# EAGLE design 153-01C Mode X LPT adapter (EAGLE 6.6.0)
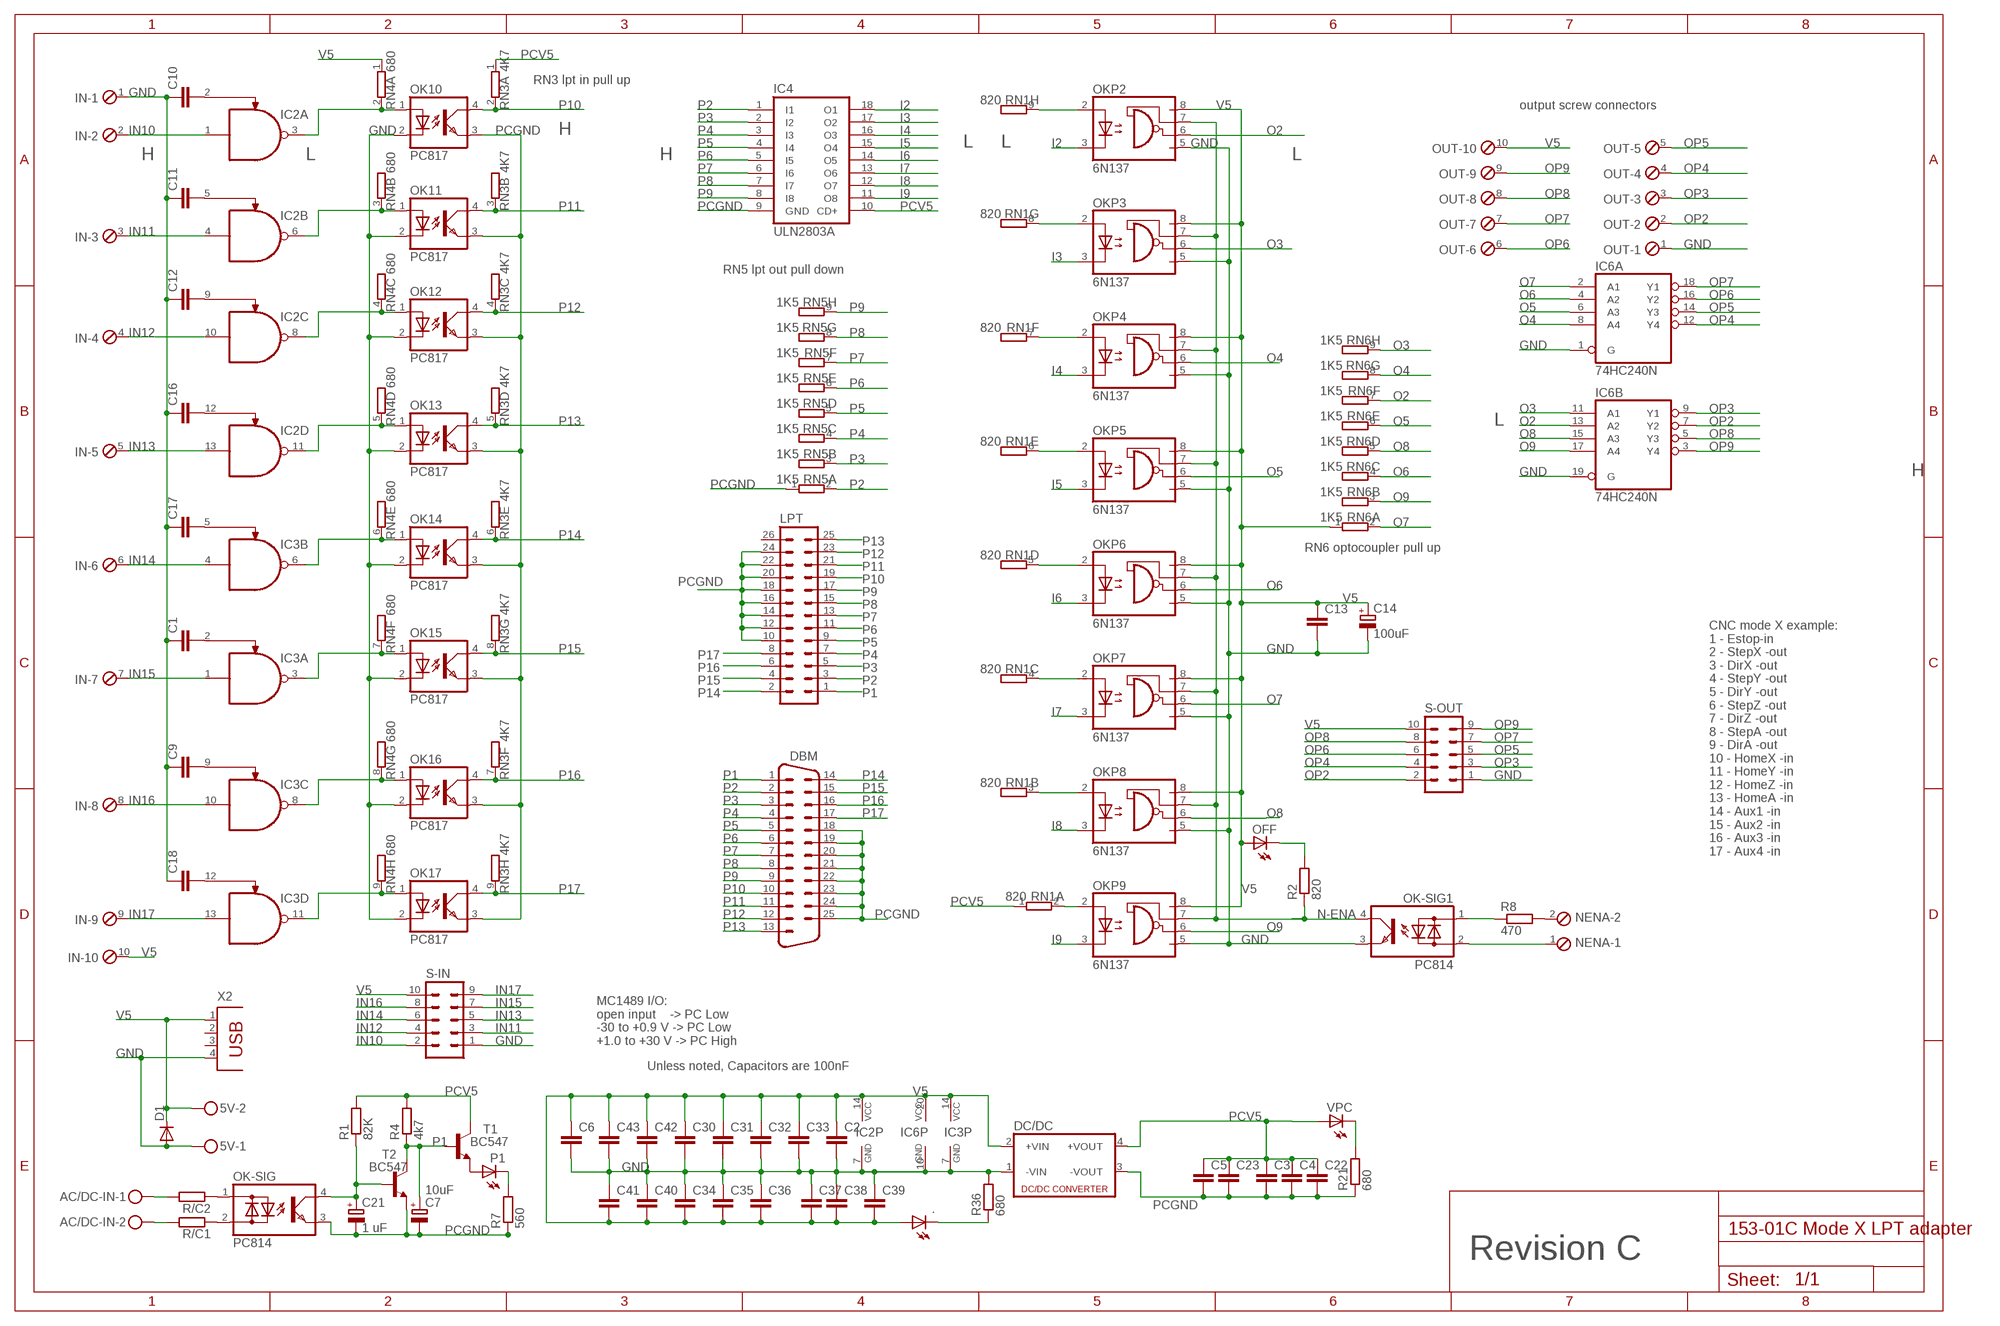
[diagram p0: schematic, sheet 1]

## Parts
5V  MKDSN1,5/2-5,08  [MKDSN1,5/2-5,08]
.  LED3MM  [LED3MM]
AC/DC-IN  MKDSN1,5/2-5,08  [MKDSN1,5/2-5,08]
C1  C-EU025-024X044  [C025-024X044]
C2  C-EU025-024X044  [C025-024X044]
C3  C-EU025-024X044  [C025-024X044]
C4  C-EU025-024X044  [C025-024X044]
C5  C-EU025-024X044  [C025-024X044]
C6  C-EU025-024X044  [C025-024X044]
C7  10uF  CPOL-EUE5-6  [E5-6]
C9  C-EU025-024X044  [C025-024X044]
C10  C-EU025-024X044  [C025-024X044]
C11  C-EU025-024X044  [C025-024X044]
C12  C-EU025-024X044  [C025-024X044]
C13  C-EU025-024X044  [C025-024X044]
C14  100uF  CPOL-EUE3.5-8  [E3,5-8]
C16  C-EU025-024X044  [C025-024X044]
C17  C-EU025-024X044  [C025-024X044]
C18  C-EU025-024X044  [C025-024X044]
C21  1 uF  CPOL-EUE2.5-6  [E2,5-6]
C22  C-EU025-024X044  [C025-024X044]
C23  C-EU025-024X044  [C025-024X044]
C30  C-EU025-024X044  [C025-024X044]
C31  C-EU025-024X044  [C025-024X044]
C32  C-EU025-024X044  [C025-024X044]
C33  C-EU025-024X044  [C025-024X044]
C34  C-EU025-024X044  [C025-024X044]
C35  C-EU025-024X044  [C025-024X044]
C36  C-EU025-024X044  [C025-024X044]
C37  C-EU025-024X044  [C025-024X044]
C38  C-EU025-024X044  [C025-024X044]
C39  C-EU025-024X044  [C025-024X044]
C40  C-EU025-024X044  [C025-024X044]
C41  C-EU025-024X044  [C025-024X044]
C42  C-EU025-024X044  [C025-024X044]
C43  C-EU025-024X044  [C025-024X044]
D1  1N4148DO35-10  [DO35-10]
DBM  M25HP  [M25HP]
DC/DC  VA-1205S  [4SIL]
IC2  MC1489DIP  [DIL14]
IC3  MC1489DIP  [DIL14]
IC4  ULN2803A  [DIL18]
IC6  74HC240N  [DIL20]
IN  MPT10  [10POL254]
LPT  ML26  [ML26]
NENA  MPT2  [2POL254]
OFF  LED3MM  [LED3MM]
OK10  PC817  [DIL04]
OK11  PC817  [DIL04]
OK12  PC817  [DIL04]
OK13  PC817  [DIL04]
OK14  PC817  [DIL04]
OK15  PC817  [DIL04]
OK16  PC817  [DIL04]
OK17  PC817  [DIL04]
OK-SIG  PC814  [DIL04]
OK-SIG1  PC814  [DIL04]
OKP2  6N137  [DIL08]
OKP3  6N137  [DIL08]
OKP4  6N137  [DIL08]
OKP5  6N137  [DIL08]
OKP6  6N137  [DIL08]
OKP7  6N137  [DIL08]
OKP8  6N137  [DIL08]
OKP9  6N137  [DIL08]
OUT  MPT10  [10POL254]
P1  LED3MM  [LED3MM]
R1  82K  R-EU_0207/10  [0207/10]
R2  820  R-EU_0207/10  [0207/10]
R4  4k7  R-EU_0207/10  [0207/10]
R7  560  R-EU_0207/10  [0207/10]
R8  470  R-EU_0207/10  [0207/10]
R21  680  R-EU_0207/10  [0207/10]
R36  680  R-EU_0207/10  [0207/10]
R/C1  R-EU_0309/10  [0309/10]
R/C2  R-EU_0309/10  [0309/10]
RN1  820  GE08R  [SIL9]
RN3  4K7  GE08R  [SIL9]
RN4  680  GE08R  [SIL9]
RN5  1K5  GE08R  [SIL9]
RN6  1K5  GE08R  [SIL9]
S-IN  ML10  [ML10]
S-OUT  ML10  [ML10]
T1  BC547  [TO92]
T2  BC547  [TO92]
VPC  LED3MM  [LED3MM]
X2  PN87520  [PN87520]

## Nets
GND: 5V.1 C1.1 C2.2 C6.2 C9.1 C10.1 C11.1 C12.1 C13.2 C14.- C16.1 C17.1 C18.1 C30.2 C31.2 C32.2 C33.2 C34.1 C35.1 C36.1 C37.1 C38.1 C39.1 C40.1 C41.1 C42.2 C43.2 D1.A DC/DC.1(-VIN) IC2.7(P:GND) IC3.7(P:GND) IC6.1(A:G) IC6.10(P:GND) IC6.19(B:G) IN.1 OK10.2(C) OK11.2(C) OK12.2(C) OK13.2(C) OK14.2(C) OK15.2(C) OK16.2(C) OK17.2(C) OK-SIG1.3(E) OKP2.5(GND) OKP3.5(GND) OKP4.5(GND) OKP5.5(GND) OKP6.5(GND) OKP7.5(GND) OKP8.5(GND) OKP9.5(GND) OUT.1 R36.2 S-IN.1 S-OUT.1 X2.4
I2: IC4.18(O1) OKP2.3(C)
I3: IC4.17(O2) OKP3.3(C)
I4: IC4.16(O3) OKP4.3(C)
I5: IC4.15(O4) OKP5.3(C)
I6: IC4.14(O5) OKP6.3(C)
I7: IC4.13(O6) OKP7.3(C)
I8: IC4.12(O7) OKP8.3(C)
I9: IC4.11(O8) OKP9.3(C)
IN10: IC2.1(A:I0) IN.2 S-IN.2
IN11: IC2.4(B:I0) IN.3 S-IN.3
IN12: IC2.10(C:I0) IN.4 S-IN.4
IN13: IC2.13(D:I0) IN.5 S-IN.5
IN14: IC3.4(B:I0) IN.6 S-IN.6
IN15: IC3.1(A:I0) IN.7 S-IN.7
IN16: IC3.10(C:I0) IN.8 S-IN.8
IN17: IC3.13(D:I0) IN.9 S-IN.9
N$1: OKP6.2(A) RN1.5
N$2: OKP9.2(A) RN1.2
N$3: C10.2 IC2.2(A:I1)
N$4: R21.2 VPC.K(C)
N$5: C17.2 IC3.5(B:I1)
N$6: OFF.K(C) R2.2
N$8: IC2.6(B:O) OK11.1(A) RN4.3
N$9: IC2.8(C:O) OK12.1(A) RN4.4
N$10: C1.2 IC3.2(A:I1)
N$11: C9.2 IC3.9(C:I1)
N$12: C18.2 IC3.12(D:I1)
N$17: IC2.3(A:O) OK10.1(A) RN4.2
N$18: IC2.11(D:O) OK13.1(A) RN4.5
N$19: IC3.6(B:O) OK14.1(A) RN4.6
N$20: IC3.3(A:O) OK15.1(A) RN4.7
N$21: IC3.8(C:O) OK16.1(A) RN4.8
N$22: OK-SIG.1(AC1) R/C2.1
N$23: OK-SIG.2(AC2) R/C1.1
N$24: IC3.11(D:O) OK17.1(A) RN4.9
N$25: AC/DC-IN.2 R/C1.2
N$26: AC/DC-IN.1 R/C2.2
N$29: OKP7.2(A) RN1.4
N$30: OKP8.2(A) RN1.3
N$32: C21.+ OK-SIG.4(C) R1.1 T2.2(B)
N$34: ..K(C) R36.1
N$39: C11.2 IC2.5(B:I1)
N$40: C12.2 IC2.9(C:I1)
N$42: C16.2 IC2.12(D:I1)
N$49: OKP5.2(A) RN1.6
N$51: OKP4.2(A) RN1.7
N$52: OK-SIG1.1(AC1) R8.1
N$54: OKP3.2(A) RN1.8
N$56: OKP2.2(A) RN1.9
N$67: P1.K(C) R7.2
N$69: P1.A T1.1(E)
N$70: NENA.2 R8.2
N$71: NENA.1 OK-SIG1.2(AC2)
N-ENA: OK-SIG1.4(C) OKP2.7(VE) OKP3.7(VE) OKP4.7(VE) OKP5.7(VE) OKP6.7(VE) OKP7.7(VE) OKP8.7(VE) OKP9.7(VE) R2.1
O2: IC6.13(B:A2) OKP2.6(VO) RN6.7
O3: IC6.11(B:A1) OKP3.6(VO) RN6.9
O4: IC6.8(A:A4) OKP4.6(VO) RN6.8
O5: IC6.6(A:A3) OKP5.6(VO) RN6.6
O6: IC6.4(A:A2) OKP6.6(VO) RN6.4
O7: IC6.2(A:A1) OKP7.6(VO) RN6.2
O8: IC6.15(B:A3) OKP8.6(VO) RN6.5
O9: IC6.17(B:A4) OKP9.6(VO) RN6.3
OP2: IC6.7(B:Y2) OUT.2 S-OUT.2
OP3: IC6.9(B:Y1) OUT.3 S-OUT.3
OP4: IC6.12(A:Y4) OUT.4 S-OUT.4
OP5: IC6.14(A:Y3) OUT.5 S-OUT.5
OP6: IC6.16(A:Y2) OUT.6 S-OUT.6
OP7: IC6.18(A:Y1) OUT.7 S-OUT.7
OP8: IC6.5(B:Y3) OUT.8 S-OUT.8
OP9: IC6.3(B:Y4) OUT.9 S-OUT.9
P1: C7.+ DBM.1 LPT.1 R4.1 T1.2(B) T2.3(C)
P2: DBM.2 IC4.1(I1) LPT.3 RN5.2
P3: DBM.3 IC4.2(I2) LPT.5 RN5.3
P4: DBM.4 IC4.3(I3) LPT.7 RN5.4
P5: DBM.5 IC4.4(I4) LPT.9 RN5.5
P6: DBM.6 IC4.5(I5) LPT.11 RN5.6
P7: DBM.7 IC4.6(I6) LPT.13 RN5.7
P8: DBM.8 IC4.7(I7) LPT.15 RN5.8
P9: DBM.9 IC4.8(I8) LPT.17 RN5.9
P10: DBM.10 LPT.19 OK10.4(COL) RN3.2
P11: DBM.11 LPT.21 OK11.4(COL) RN3.3
P12: DBM.12 LPT.23 OK12.4(COL) RN3.4
P13: DBM.13 LPT.25 OK13.4(COL) RN3.5
P14: DBM.14 LPT.2 OK14.4(COL) RN3.6
P15: DBM.15 LPT.4 OK15.4(COL) RN3.8
P16: DBM.16 LPT.6 OK16.4(COL) RN3.7
P17: DBM.17 LPT.8 OK17.4(COL) RN3.9
PCGND: C3.2 C4.2 C5.2 C7.- C21.- C22.2 C23.2 DBM.18 DBM.19 DBM.20 DBM.21 DBM.22 DBM.23 DBM.24 DBM.25 DC/DC.3(-VOUT) IC4.9(GND) LPT.10 LPT.12 LPT.14 LPT.16 LPT.18 LPT.20 LPT.22 LPT.24 OK10.3(EMIT) OK11.3(EMIT) OK12.3(EMIT) OK13.3(EMIT) OK14.3(EMIT) OK15.3(EMIT) OK16.3(EMIT) OK17.3(EMIT) OK-SIG.3(E) R7.1 R21.1 RN5.1 T2.1(E)
PCV5: C3.1 C4.1 C5.1 C22.1 C23.1 DC/DC.4(+VOUT) IC4.10(CD+) R1.2 R4.2 RN1.1 RN3.1 T1.3(C) VPC.A
V5: 5V.2 ..A C2.1 C6.1 C13.1 C14.+ C30.1 C31.1 C32.1 C33.1 C34.2 C35.2 C36.2 C37.2 C38.2 C39.2 C40.2 C41.2 C42.1 C43.1 D1.C DC/DC.2(+VIN) IC2.14(P:VCC) IC3.14(P:VCC) IC6.20(P:VCC) IN.10 OFF.A OKP2.8(VCC) OKP3.8(VCC) OKP4.8(VCC) OKP5.8(VCC) OKP6.8(VCC) OKP7.8(VCC) OKP8.8(VCC) OKP9.8(VCC) OUT.10 RN4.1 RN6.1 S-IN.10 S-OUT.10 X2.1
Unconnected: LPT.26 X2.2 X2.3

## Notes on the sheet
- RN3 lpt in pull up
- output screw connectors
- H
- L | L
- H | L | H | L
- RN5 lpt out pull down
- L
- H
- RN6 optocoupler pull up
- CNC mode X example:
  1 - Estop-in
  2 - StepX -out
  3 - DirX -out
  4 - StepY -out
  5 - DirY -out
  6 - StepZ -out
  7 - DirZ -out
  8 - StepA -out
  9 - DirA -out
  10 - HomeX -in
  11 - HomeY -in
  12 - HomeZ -in
  13 - HomeA -in
  14 - Aux1 -in
  15 - Aux2 -in
  16 - Aux3 -in
  17 - Aux4 -in
- MC1489 I/O:
  open input    -> PC Low
  -30 to +0.9 V -> PC Low
  +1.0 to +30 V -> PC High
- Unless noted, Capacitors are 100nF
- Revision C

## Library data of the parts
5V AC/DC-IN = con-phoenix-508:MKDSN1,5/2-5,08: MKDSN 1,5/ 2-5,08 Printklemme Nennstrom: 13,5 A Nennspannung: 250 V Rastermaß: 5,08 mm Polzahl: 2 Anschlussart: Schraubanschluss Montage: Löten Anschlussrichtung Leiter/Platine: 0 ° Artikelnummer: 1729128 Source: http://eshop.phoenixcontact.com .. 1729128.pdf
. OFF P1 VPC = led:LED: LED OSRAM: - CHIPLED LG R971, LG N971, LY N971, LG Q971, LY Q971, LO R971, LY R971 LH N974, LH R974 LS Q976, LO Q976, LY Q976 LO Q996 - Hyper CHIPLED LW Q18S LB Q993, LB Q99A, LB R99A - SideLED LS A670, LO A670, LY A670, LG A670, LP A670 LB A673, LV A673, LT A673, LW A673 LH A674 LY A675 LS A676, LA A676, LO A676, LY A676, LW A676 LS A679, LY A679, LG A679 - Hyper Micro SIDELED® LS Y876, LA Y876, LO Y876, LY Y876 LT Y87S - SmartLED LW L88C, LW L88S LB L89C, LB L89S, LG L890 LS L89K, LO L89K, LY L89K LS L896, LA L896, LO L896, LY L896 - TOPLED LS T670, LO T670, LY T670, LG T670, LP T670 LSG T670, LSP T670, LSY T670, LOP T670, LYG T670 LG T671, LOG T671, LSG T671 LB T673, LV T673, LT T673, LW T673 LH T674 LS T676, LA T676, LO T676, LY T676, LB T676, LH T676, LSB T676, LW T676 LB T67C, LV T67C, LT T67C, LS T67K, LO T67K, LY T67K, LW E67C LS E67B, LA E67B, LO E67B, LY E67B, LB E67C, LV E67C, LT E67C LW T67C LS T679, LY T679, LG T679 LS T770, LO T770, LY T770, LG T770, LP T770 LB T773, LV T773, LT T773, LW T773 LH T774 LS E675, LA E675, LY E675, LS T675 LS T776, LA T776, LO T776, LY T776, LB T776 LHGB T686 LT T68C, LB T68C - Hyper Mini TOPLED® LB M676 - Mini TOPLED Santana® LG M470 LS M47K, LO M47K, LY M47K Source: http://www.osram.convergy.de LUXEON: - LUMILED® LXK2-PW12-R00, LXK2-PW12-S00, LXK2-PW14-U00, LXK2-PW14-V00 LXK2-PM12-R00, LXK2-PM12-S00, LXK2-PM14-U00 LXK2-PE12-Q00, LXK2-PE12-R00, LXK2-PE12-S00, LXK2-PE14-T00, LXK2-PE14-U00 LXK2-PB12-K00, LXK2-PB12-L00, LXK2-PB12-M00, LXK2-PB14-N00, LXK2-PB14-P00, LXK2-PB14-Q00 LXK2-PR12-L00, LXK2-PR12-M00, LXK2-PR14-Q00, LXK2-PR14-R00 LXK2-PD12-Q00, LXK2-PD12-R00, LXK2-PD12-S00 LXK2-PH12-R00, LXK2-PH12-S00 LXK2-PL12-P00, LXK2-PL12-Q00, LXK2-PL12-R00 Source: www.luxeon.com KINGBRIGHT: KA-3528ASYC Source: www.kingbright.com
C1-C6 C9-C13 C16-C18 C22 C23 C30-C43 = rcl:C-EU: CAPACITOR, European symbol
C7 C14 C21 = rcl:CPOL-EU: POLARIZED CAPACITOR, European symbol
D1 = my-components:1N4148: DIODE high speed (Philips)
DBM = my-components:M25: SUB-D; OC_FARNELL: unknown; OC_NEWARK: unknown
DC/DC = dc-dc-converter:VA-*?: DC DC Converter Single Output, 1 Watt Motien Technology Co.,Ltd. Source: Data sheet <http://www.motien.com.tw/data_sheet/VA-1%28H%29.pdf>; OC_FARNELL: unknown; OC_NEWARK: unknown
IC2 IC3 = My components:MC1489DIP: MC1489 quad line receiver DIP14
IC4 = uln-udn:ULN2803A: DRIVER ARRAY
IC6 = 74xx-eu:74*240: Octal BUFFER and LINE DRIVER, 3-state
IN OUT = con-phoenix-254:MPT10: PHOENIX CONNECTOR; OC_FARNELL: unknown; OC_NEWARK: unknown
LPT = con-harting-ml:ML26: HARTING; OC_FARNELL: unknown; OC_NEWARK: unknown
NENA = con-phoenix-254:MPT2: PHOENIX CONNECTOR; OC_FARNELL: unknown; OC_NEWARK: unknown
OK10-OK17 = optocoupler:PC817: SHARP OPTO COUPLER; MPN: PC817X4J000F; OC_FARNELL: 9707727; OC_NEWARK: 97K7059
OK-SIG OK-SIG1 = optocoupler:PC814: SHARP OPTO COUPLER; OC_FARNELL: 9707662; OC_NEWARK: unknown
OKP2-OKP9 = optocoupler:6N137: MOTOROLA OPTO COUPLER; MPN: 6N137; OC_FARNELL: 1328376; OC_NEWARK: 52M1895
R1 R2 R4 R7 R8 R21 R36 R/C1 R/C2 = rcl:R-EU_: RESISTOR, European symbol
RN1 RN3-RN6 = resistor-sil:GE08R: SIL RESISTOR; OC_FARNELL: unknown; OC_NEWARK: unknown
S-IN S-OUT = con-harting-ml:ML10: HARTING; OC_FARNELL: unknown; OC_NEWARK: unknown
T1 T2 = transistor:BC547: NPN TRANSISTOR
X2 = con-berg:PN87520: BERG USB connector; OC_FARNELL: unknown; OC_NEWARK: unknown

## Board
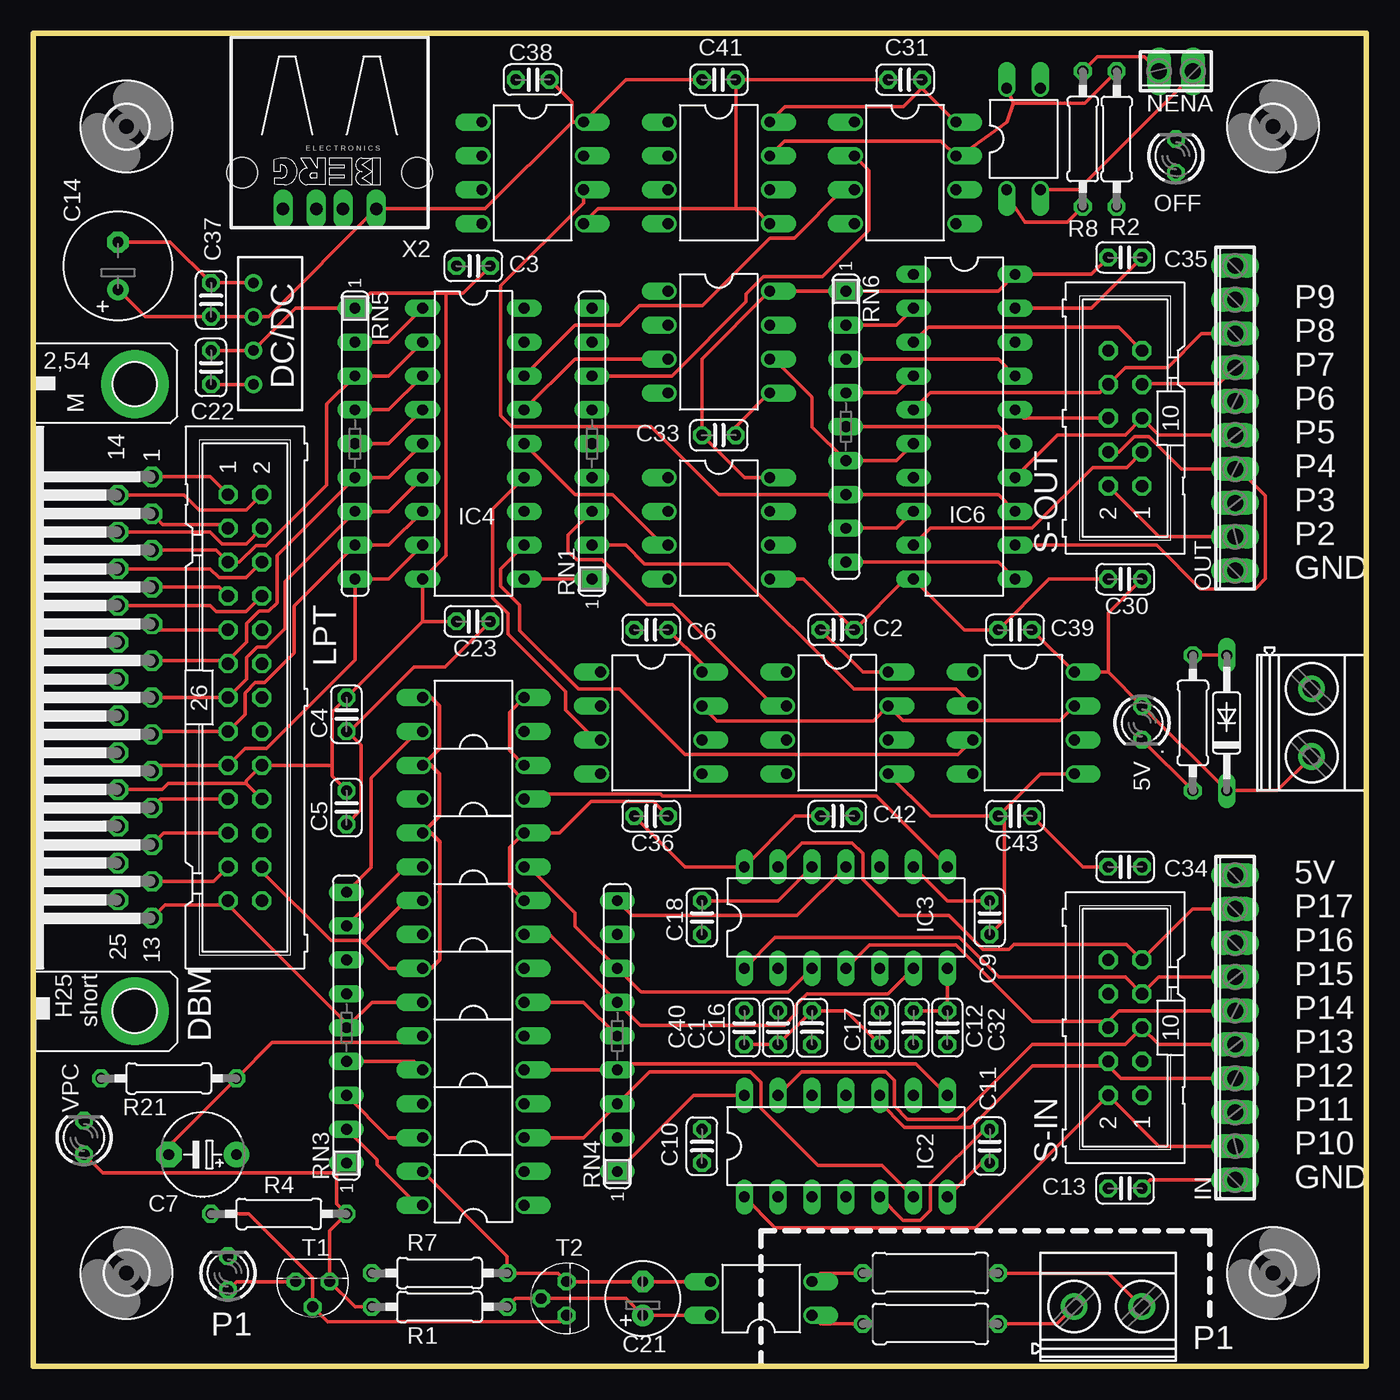
[diagram p1: board, top side]
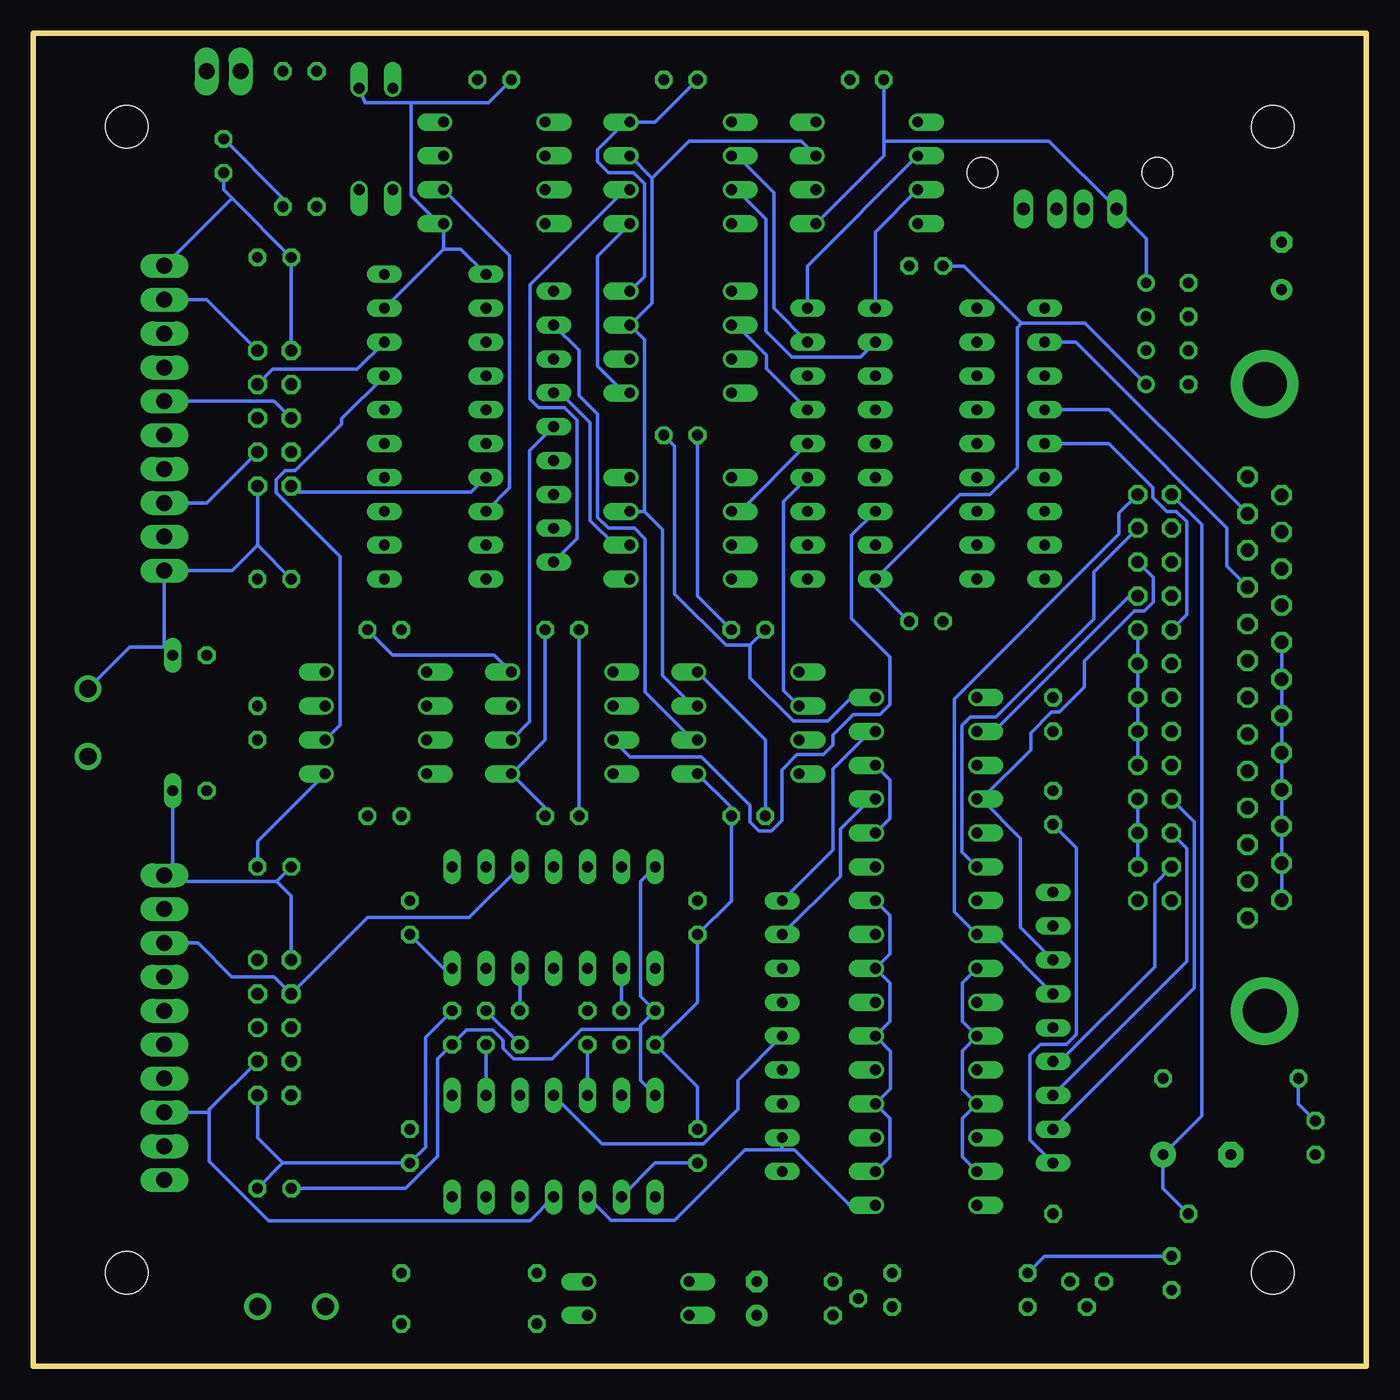
[diagram p2: board, bottom side, seen from below]

Size 100 x 100 mm. Coordinates in mm from the lower left corner, seen from the top.
Outline: 100,100 100,0 0,0 0,100 100,100
Copper layers (1*16): Top 0.035mm / dielectric 1.5mm / Bottom 0.035mm
Design rules "default *": minimum track width 10mil, minimum drill 24mil, track to track 12mil, track to pad 12mil, pad to pad 15mil, via to via 8mil, smd to smd 8mil, copper to edge 20mil, drill to drill 15mil, minimum pad ring 10mil, minimum via ring 8mil, stop-mask expansion 4mil, vias tented up to drill 0mil, thermal gap 10mil

### Footprints (pad centres in the part's own frame; a part is rotated, then mirrored left to right if it is on the bottom)
MKDSN1,5/2-5,08 = drill 1.3 pad 2: 1 -2.561,0.025; 2 2.519,0.025
LED3MM = drill 0.813 octagon: A -1.27,0; K 1.27,0
C025-024X044 = drill 0.813 octagon: 1 -1.27,0; 2 1.27,0
E5-6 = drill 0.813 pad 1.905: + -2.54,0 | drill 0.813 pad 1.905 octagon: - 2.54,0
E3,5-8 = drill 0.813 pad 1.6: + -1.778,0 | drill 0.813 pad 1.6 octagon: - 1.778,0
E2,5-6 = drill 0.813 pad 1.6: + -1.27,0 | drill 0.813 pad 1.6 octagon: - 1.27,0
DO35-10 = drill 0.813 long: A 5.08,0; C -5.08,0
M25HP = drill 1.016 octagon: 1 -16.561,1.27; 2 -13.792,1.27; 3 -11.049,1.27; 4 -8.28,1.27; 5 -5.512,1.27; 6 -2.769,1.27; 7 0,1.27; 8 2.769,1.27; 9 5.512,1.27; 10 8.28,1.27; 11 11.049,1.27; 12 13.792,1.27; 13 16.561,1.27; 14 -15.189,-1.27; 15 -12.421,-1.27; 16 -9.652,-1.27; 17 -6.909,-1.27; 18 -4.14,-1.27; 19 -1.372,-1.27; 20 1.372,-1.27; 21 4.14,-1.27; 22 6.909,-1.27; 23 9.652,-1.27; 24 12.421,-1.27; 25 15.189,-1.27 | drill 3.302 pad 5.08: G1 -23.52,0; G2 23.52,0
4SIL = drill 0.8: 1 -3.81,0; 2 -1.27,0; 3 1.27,0; 4 3.81,0
DIL14 = drill 0.813 long: 1 -7.62,-3.81; 2 -5.08,-3.81; 3 -2.54,-3.81; 4 0,-3.81; 5 2.54,-3.81; 6 5.08,-3.81; 7 7.62,-3.81; 8 7.62,3.81; 9 5.08,3.81; 10 2.54,3.81; 11 0,3.81; 12 -2.54,3.81; 13 -5.08,3.81; 14 -7.62,3.81
DIL18 = drill 0.813 long: 1 -10.16,-3.81; 2 -7.62,-3.81; 3 -5.08,-3.81; 4 -2.54,-3.81; 5 0,-3.81; 6 2.54,-3.81; 7 5.08,-3.81; 8 7.62,-3.81; 9 10.16,-3.81; 10 10.16,3.81; 11 7.62,3.81; 12 5.08,3.81; 13 2.54,3.81; 14 0,3.81; 15 -2.54,3.81; 16 -5.08,3.81; 17 -7.62,3.81; 18 -10.16,3.81
DIL20 = drill 0.813 long: 1 -11.43,-3.81; 2 -8.89,-3.81; 3 -6.35,-3.81; 4 -3.81,-3.81; 5 -1.27,-3.81; 6 1.27,-3.81; 7 3.81,-3.81; 8 6.35,-3.81; 9 8.89,-3.81; 10 11.43,-3.81; 11 11.43,3.81; 12 8.89,3.81; 13 6.35,3.81; 14 3.81,3.81; 15 1.27,3.81; 16 -1.27,3.81; 17 -3.81,3.81; 18 -6.35,3.81; 19 -8.89,3.81; 20 -11.43,3.81
10POL254 = drill 1.2 long: 1 -11.43,0; 2 -8.89,0; 3 -6.35,0; 4 -3.81,0; 5 -1.27,0; 6 1.27,0; 7 3.81,0; 8 6.35,0; 9 8.89,0; 10 11.43,0
ML26 = drill 0.914 octagon: 1 -15.24,-1.27; 2 -15.24,1.27; 3 -12.7,-1.27; 4 -12.7,1.27; 5 -10.16,-1.27; 6 -10.16,1.27; 7 -7.62,-1.27; 8 -7.62,1.27; 9 -5.08,-1.27; 10 -5.08,1.27; 11 -2.54,-1.27; 12 -2.54,1.27; 13 0,-1.27; 14 0,1.27; 15 2.54,-1.27; 16 2.54,1.27; 17 5.08,-1.27; 18 5.08,1.27; 19 7.62,-1.27; 20 7.62,1.27; 21 10.16,-1.27; 22 10.16,1.27; 23 12.7,-1.27; 24 12.7,1.27; 25 15.24,-1.27; 26 15.24,1.27
2POL254 = drill 1.2 long: 1 -1.27,0; 2 1.27,0
DIL04 = drill 0.813 offset: 1 -1.27,-3.81; 2 1.27,-3.81; 3 1.27,3.81; 4 -1.27,3.81
DIL08 = drill 0.813 offset: 1 -3.81,-3.81; 2 -1.27,-3.81; 3 1.27,-3.81; 4 3.81,-3.81; 5 3.81,3.81; 6 1.27,3.81; 7 -1.27,3.81; 8 -3.81,3.81
0207/10 = drill 0.813 octagon: 1 -5.08,0; 2 5.08,0
0309/10 = drill 0.813 octagon: 1 -5.08,0; 2 5.08,0
SIL9 = drill 0.813 long: 1 -10.16,0; 2 -7.62,0; 3 -5.08,0; 4 -2.54,0; 5 0,0; 6 2.54,0; 7 5.08,0; 8 7.62,0; 9 10.16,0
ML10 = drill 0.914 octagon: 1 -5.08,-1.27; 2 -5.08,1.27; 3 -2.54,-1.27; 4 -2.54,1.27; 5 0,-1.27; 6 0,1.27; 7 2.54,-1.27; 8 2.54,1.27; 9 5.08,-1.27; 10 5.08,1.27
TO92 = drill 0.813 octagon: 1 1.27,0; 2 0,1.905; 3 -1.27,0
3,2 = hole 3.2: 0,0
PN87520 = drill 0.95 long: 1 -3.5,2.71; 2 -1,2.71; 3 1,2.71; 4 3.5,2.71 | hole 2.3: -6.57,0; 6.57,0

### Placement (x,y rotation side)
5V  95.89,48.26 270 top
.  83.19,48.26 270 top
AC/DC-IN  80.64,4.45 0 top
C1  55.88,25.4 90 top
C2  60.33,55.24 0 top
C3  33.02,82.55 0 top
C4  23.5,48.9 90 top
C5  23.5,41.91 90 top
C6  46.35,55.24 180 top
C7  12.7,15.88 180 top
C9  71.75,33.66 90 top
C10  50.16,16.51 270 top
C11  71.75,16.51 90 top
C12  66.04,25.4 270 top
C13  81.92,13.34 0 top
C14  6.35,82.55 90 top
C16  58.42,25.4 270 top
C17  63.5,25.4 90 top
C18  50.16,33.66 90 top
C21  45.72,5.08 90 top
C22  13.34,74.93 90 top
C23  33.02,55.88 180 top
C30  81.92,59.05 180 top
C31  65.41,96.52 180 top
C32  68.58,25.4 90 top
C33  51.44,69.85 0 top
C34  81.92,37.47 180 top
C35  81.92,83.19 180 top
C36  46.35,41.27 180 top
C37  13.34,80.01 270 top
C38  37.47,96.52 0 top
C39  73.66,55.24 0 top
C40  53.34,25.4 90 top
C41  51.44,96.52 180 top
C42  60.33,41.27 0 top
C43  73.66,41.27 180 top
D1  89.53,48.26 90 top
DBM  7.62,50.16 270 top
DC/DC  16.51,77.47 270 top
IC2  60.96,16.51 0 top
IC3  60.96,33.66 0 top
IC4  33.02,69.22 270 top
IC6  69.85,70.48 270 top
IN  90.17,25.4 90 top
LPT  15.88,50.16 270 top
NENA  85.72,97.16 180 top
OFF  85.72,90.81 90 top
OK10  33.02,13.34 90 top
OK11  33.02,18.41 90 top
OK12  33.02,23.5 90 top
OK13  33.02,28.57 90 top
OK14  33.02,33.66 90 top
OK15  33.02,38.73 90 top
OK16  33.02,43.81 90 top
OK17  33.02,48.9 90 top
OK-SIG  54.61,5.08 90 top
OK-SIG1  74.3,92.08 0 top
OKP2  37.47,89.53 270 top
OKP3  51.44,89.53 270 top
OKP4  65.41,89.53 270 top
OKP5  51.44,76.83 270 top
OKP6  51.44,62.87 270 top
OKP7  46.35,48.26 270 top
OKP8  60.33,48.26 270 top
OKP9  74.3,48.26 270 top
OUT  90.17,71.12 90 top
P1  14.61,6.99 90 top
R1  30.48,4.45 180 top
R2  81.28,92.08 270 top
R4  18.41,11.43 0 top
R7  30.48,6.99 180 top
R8  78.74,92.08 90 top
R21  10.16,21.59 180 top
R36  87,48.26 90 top
R/C1  67.31,6.99 0 top
R/C2  67.31,3.17 0 top
RN1  41.91,69.22 90 top
RN3  23.5,25.4 90 top
RN4  43.81,24.77 90 top
RN5  24.13,69.22 270 top
RN6  60.96,70.48 270 top
S-IN  81.92,25.4 90 top
S-OUT  81.92,71.12 90 top
T1  20.95,6.35 180 top
T2  40.01,5.08 90 top
U$1  [3,2]  7,7 0 top
U$2  [3,2]  93,7 0 top
U$3  [3,2]  93,93 0 top
U$4  [3,2]  7,93 0 top
VPC  3.81,17.14 90 top
X2  22.23,89.53 180 top

### Tracks (layer width: path | path; a pad name or v marks a point on that pad's centre or on a via)
GND
  Top 0.254: OKP5.5 52.7,70.48 C33.2 | IC3.7 C32.2 C12.1 | 52.7,86.84 42.39,86.84 OKP2.5 | OKP3.5 54.13,86.84 52.7,86.84 | 52.7,86.84 C41.1 C31.2 | OK14.2 35.73,36.03 35.73,38.9 OK15.2 39.48,40.01 41.84,42.37 46.53,42.37 C36.1 | IC6.19 79.38,79.38 C35.1 | C11.1 71.12,15.24 IC2.7 | C17.1 60.96,26.67 C16.1 C1.1 C40.1 | C43.2 72.86,40.81 72.86,33.49 C9.1 | OKP8.5 67.31,41.27 C43.2 | OK17.2 35.73,49.06 35.73,46.19 OK16.2 | C30.2 76.2,59.05 C39.1 69.85,55.24 IC6.10 65.41,59.05 C2.2 57.78,59.05 OKP6.5 | C14.- 10.29,84.33 C37.1 DC/DC.1 | R36.2 D1.A | IN.1 83.82,13.97 C13.2 | OKP9.5 75.56,44.45 C43.2
  Bottom 0.254: OKP7.5 47.62,41.91 C36.1 47.62,34.92 C18.1 50.16,27.3 C40.1 50.16,20.95 C10.1 | 36.2,91.92 36.2,90.81 OKP2.5 | C38.1 36.2,91.92 | 36.2,91.92 23.82,91.92 X2.4 16.51,84.61 DC/DC.1 | C9.1 69.22,29.84 IC3.7 | OKP3.5 57.67,83.3 57.67,75.03 55.67,73.03 OKP5.5 | 46.22,54.11 C6.2 | C33.2 51.88,69.03 51.88,57.95 48.05,54.11 46.22,54.11 | OK17.2 38.62,50.16 40.38,48.41 42.98,48.41 46.22,51.65 46.22,54.11 | OK16.2 35.73,43.98 35.73,41.11 OK15.2 | OK10.2 35.74,15.7 35.74,18.59 OK11.2 35.69,20.82 35.69,23.63 OK12.2 35.74,25.86 35.74,28.75 OK13.2 35.74,30.94 35.74,33.83 OK14.2 | 90.17,53.98 D1.A | 90.17,53.98 OUT.1 85.09,59.69 83.19,61.59 | 90.17,53.98 92.76,53.98 5V.1 | IC6.19 69.22,83.82 | 83.19,61.59 S-OUT.1 | C30.2 83.19,61.59 | 71.67,94.79 75.11,94.79 OK-SIG1.3 | C31.2 65.86,94.79 71.67,94.79 | 71.67,94.79 71.67,87.82 69.57,85.72 OKP4.5 69.22,83.82 | C32.2 70.58,24.67 70.58,16.41 C11.1 81.28,15.24 | 81.28,15.24 C13.2 | S-IN.1 83.19,17.14 81.28,15.24 | 69.22,83.82 67.94,83.82 IC6.1 | C12.1 C17.1 | C2.2 61.59,46.99 OKP8.5 61.59,41.91 C42.2 | C34.1 83.19,39.37 OKP9.5
I2
  Bottom 0.254: OKP2.3 36.83,85.09 IC4.18
I3
  Bottom 0.254: OKP3.3 47.24,88.27 45.02,86.04 45.02,77.67 43.07,75.72 37.94,75.72 IC4.17
I4
  Top 0.254: OKP4.3 60.72,88.27 57.09,84.63 55.28,84.63 50.2,79.55 45.48,79.55 44.04,78.11 40.64,78.11 IC4.16
I5
  Top 0.254: OKP5.3 40.64,75.56 IC4.15
I6
  Top 0.254: OKP6.3 47.26,61.59 43.45,65.41 40.64,65.41 IC4.14
I7
  Top 0.254: OKP7.3 42.17,46.99 39.93,49.23 39.93,50.62 35.6,54.94 35.6,56.47 34.46,57.62 34.46,64.31 IC4.13
I8
  Bottom 0.254: OKP8.3 55.24,45.72 49.87,45.72 46.23,42.09 46.23,40.84 45.57,40.17 44.63,40.17 43.84,40.96 43.84,44.74 42.7,45.88 40.72,45.88 40.01,46.6 40.01,47.35 38.46,48.9 36.49,48.9 35.73,49.65 35.73,53.2 38.62,56.08 38.62,62.35 IC4.12
I9
  Top 0.254: OKP9.3 69.39,45.89 48.88,45.89 43.97,50.8 40.9,50.8 36.49,55.2 36.49,57.1 35.04,58.55 35.04,59.81 IC4.11
IN10
  Top 0.254: IC2.1 55.65,10.39 70.71,10.39 S-IN.2 84.45,16.51 IN.2
IN11
  Bottom 0.254: 86.79,19.05 86.79,15.38 82.33,10.91 62.75,10.91 IC2.4 | S-IN.3 86.79,19.25 86.79,19.05 | 86.79,19.05 IN.3
IN12
  Top 0.254: 80.64,22.53 74.95,22.53 70.33,17.91 65.37,17.91 63.5,19.78 IC2.10 | IN.4 81.58,21.59 80.64,22.53 | S-IN.4 80.64,22.53
IN13
  Top 0.254: IC2.13 57.65,22.09 63.96,22.09 64.6,21.44 64.6,19.51 65.6,18.52 69.35,18.52 74.96,24.13 81.92,24.13 S-IN.5 84.45,24.13 IN.5
IN14
  Top 0.254: 80.64,25.86 74.95,25.86 69.22,31.6 62.71,31.6 IC3.4 | IN.6 81.45,26.67 80.64,25.86 | 80.64,25.86 S-IN.6
IN15
  Top 0.254: IC3.1 55.65,32.16 69.5,32.16 72.44,29.21 81.92,29.21 S-IN.7 84.45,29.21 IN.7
IN16
  Bottom 0.254: IC3.10 67.31,33.66 74.93,33.66 S-IN.8 81.92,29.21 85.11,29.21 87.65,31.75 IN.8
IN17
  Top 0.254: IC3.13 57.67,39.26 61.44,39.26 62.23,38.46 62.23,36.53 64.94,33.82 68.71,33.82 71.26,31.27 73.2,31.27 73.58,31.65 82.01,31.65 S-IN.9 87,34.29 IN.9
N$1
  Bottom 0.254: RN1.5 46.99,64.14 OKP6.2
N$2
  Top 0.254: RN1.2 44.45,61.59 45.85,60.2 52.17,60.2 61.57,50.8 69.22,50.8 OKP9.2
N$3
  Bottom 0.254: IC2.2 53.34,15.24 C10.2
N$4
  Bottom 0.254: VPC.K 5.08,19.68 R21.2
N$5
  Bottom 0.254: IC3.5 C17.2
N$6
  Bottom 0.254: R2.2 81.28,87.63 OFF.K
N$8
  Top 0.254: IC2.6 63.68,15.06 58.88,15.06 54.61,19.33 54.61,21.28 53.81,22.09 46.22,22.09 RN4.3 41.27,17.14 OK11.1
N$9
  Top 0.254: IC2.8 66.22,22.68 44.27,22.68 RN4.4 OK12.1
N$10
  Bottom 0.254: IC3.2 C1.2
N$11
  Top 0.254: IC3.9 68.58,34.92 C9.2
N$12
  Top 0.254: IC3.12 55.88,34.92 C18.2
N$17
  Bottom 0.254: 43.81,16.23 46.61,16.23 51.91,10.93 56.65,10.93 IC2.3 | OK10.1 38.73,12.06 42.9,16.23 43.81,16.23 | RN4.2 43.81,16.23
N$18
  Top 0.254: RN4.5 41.27,27.3 OK13.1
  Bottom 0.254: RN4.5 47.12,21.46 47.12,19.27 49.7,16.68 57.33,16.68 IC2.11
N$19
  Top 0.254: IC3.6 64.12,27.93 58.06,27.93 57.27,27.14 57.27,26.51 56.34,25.58 45.54,25.58 RN4.6 38.73,32.38 OK14.1
N$20
  Top 0.254: IC3.3 56.65,28.07 45.59,28.07 RN4.7 40.65,33.01 40.65,34.01 37.2,37.47 OK15.1
N$21
  Top 0.254: OK16.1 37.22,42.93 47.05,42.93 47.21,42.77 63.27,42.77 IC3.8
  Bottom 0.254: RN4.8 39.45,36.75 39.45,40.29 37.2,42.55 OK16.1
N$22
  Top 0.254: R/C2.1 59.05,3.17 OK-SIG.1
N$23
  Top 0.254: R/C1.1 59.05,6.99 OK-SIG.2
N$24
  Top 0.254: RN4.9 44.92,33.82 57.31,33.82 IC3.11
  Bottom 0.254: RN4.9 40.01,38.73 40.01,44.81 37.2,47.62 OK17.1
N$25
  Top 0.254: R/C1.2 80.65,6.99 AC/DC-IN.2
N$26
  Top 0.254: R/C2.2 76.79,3.17 AC/DC-IN.1
N$29
  Bottom 0.254: RN1.4 43.72,64.86 43.72,50.71 OKP7.2
N$30
  Top 0.254: RN1.3 40.12,62.35 40.12,61.13 40.74,60.5 42.67,60.5 46.03,57.15 47.96,57.15 55.58,49.53 OKP8.2
N$32
  Top 0.254: OK-SIG.4 C21.+ 44.45,5.08 T2.2 36.2,5.08 R1.1
N$34
  Top 0.254: R36.1 ..K
N$39
  Top 0.254: IC2.5 65.25,10.95 66.57,10.95 67.31,11.68 67.31,13.7 71.39,17.78 C11.2
N$40
  Bottom 0.254: IC2.9 C12.2
N$42
  Bottom 0.254: IC2.12 C16.2
N$49
  Bottom 0.254: RN1.6 45.01,74.85 45.01,75.85 47.26,78.11 OKP5.2
N$51
  Top 0.254: RN1.7 47.91,74.3 53.47,79.85 53.47,80.42 54.79,81.74 59.2,81.74 62.7,85.23 62.7,89.7 OKP4.2
N$52
  Top 0.254: R8.1 77.59,85.85 74.41,85.85 73.03,87.86 OK-SIG1.1
N$54
  Bottom 0.254: RN1.8 44.45,79.38 44.45,88.06 47.19,90.81 OKP3.2
N$56
  Bottom 0.254: RN1.9 41.91,82.55 OKP2.2
N$67
  Bottom 0.254: R7.2 24.13,8.26 P1.K
N$69
  Top 0.254: T1.1 15.24,6.35 P1.A
N$70
  Top 0.254: R8.2 79.83,98.25 83.36,98.25 NENA.2
N$71
  Top 0.254: OK-SIG1.2 78.4,88.27 87,96.86 NENA.1
N-ENA
  Top 0.254: OKP7.7 51.28,48.42 63.02,48.42 OKP8.7 65.24,48.43 77,48.43 OKP9.7 | 73.52,94.76 73.03,93.34 69.56,90.81 OKP4.7 68.1,91.92 56.36,91.92 OKP3.7 | 73.52,94.76 OK-SIG1.4 | R2.1 78.89,94.76 74.78,94.76 73.52,94.76
  Bottom 0.254: 53.59,89.15 53.59,79.76 OKP5.7 54.15,77.01 54.15,64.14 | OKP3.7 53.59,89.15 | 53.59,89.15 50.82,91.92 42.39,91.92 OKP2.7 | OKP7.7 50.5,49.53 52.79,51.82 52.79,62.78 54.15,64.14 | 54.15,64.14 OKP6.7
O2
  Top 0.254: IC6.13 72.39,65.41 RN6.7 51.44,65.41 46.35,70.48 35.89,70.48 35.07,71.3 35.07,81.07 41.27,87.27 OKP2.6
O3
  Top 0.254: RN6.9 72.39,60.33 IC6.11
  Bottom 0.254: OKP3.6 55.6,88.27 62.71,81.15 62.71,72.56 62.08,71.92 60.15,71.92 59.2,70.97 59.2,62.08 RN6.9
O4
  Top 0.254: RN6.8 64.77,62.87 IC6.8
  Bottom 0.254: OKP4.6 64.25,83.31 64.25,65.92 IC6.8
O5
  Top 0.254: OKP5.6 55.57,75.56 58.43,72.7 58.43,70.47 RN6.6 64.77,67.94 IC6.6
O6
  Top 0.254: RN6.4 64.77,73.03 IC6.4
  Bottom 0.254: OKP6.6 56.36,61.59 58.22,63.45 58.22,70.78 60.47,73.03 RN6.4
O7
  Top 0.254: RN6.2 64.77,78.11 IC6.2
  Bottom 0.254: OKP7.6 50.51,46.99 54.1,50.59 54.1,62.06 54.91,62.87 56.84,62.87 57.66,63.68 57.66,71.42 59.07,72.84 59.07,76.22 RN6.2
O8
  Top 0.254: RN6.5 72.39,70.48 IC6.15
  Bottom 0.254: RN6.5 62.77,68.68 62.77,48.36 OKP8.6
O9
  Top 0.254: RN6.3 72.39,75.56 IC6.17
  Bottom 0.254: OKP9.6 77,48.1 77,60.73 81.79,65.53 81.79,66.51 81.12,67.18 80.35,67.18 76.86,70.67 76.86,71.1 IC6.17
OP2
  Top 0.254: S-OUT.2 84.45,62.23 OUT.2
  Bottom 0.254: S-OUT.2 80.17,65.56 67.15,65.56 IC6.7
OP3
  Top 0.254: S-OUT.3 82.04,67.44 79.5,67.44 74.93,62.87 67.31,62.87 IC6.9
  Bottom 0.254: S-OUT.3 87,64.77 OUT.3
OP4
  Top 0.254: IC6.12 84.3,61.59 87.57,58.32 91.66,58.32 92.45,59.1 92.45,65.32 90.46,67.31 OUT.4 86.14,67.31 83.71,69.74 82.6,69.74 81.44,68.58 S-OUT.4
OP5
  Top 0.254: IC6.14 76.83,69.85 81.92,69.85 S-OUT.5 84.45,69.85 OUT.5
OP6
  Top 0.254: S-OUT.6 74.3,71.12 IC6.16
  Bottom 0.254: OUT.6 81.92,72.39 S-OUT.6
OP7
  Top 0.254: S-OUT.7 83.25,73.72 88.96,73.72 OUT.7
  Bottom 0.254: S-OUT.7 82.04,74.8 75.69,74.8 IC6.18
OP8
  Top 0.254: IC6.5 67.31,73.03 80.01,73.03 S-OUT.8 81.92,74.93 85.11,74.93 87.65,77.47 OUT.8
OP9
  Top 0.254: S-OUT.9 81.44,77.95 67.15,77.95 IC6.3
  Bottom 0.254: S-OUT.9 87,80.01 OUT.9
P1
  Top 0.254: T2.3 39.52,3.33 22.07,3.33 T1.2 20.95,6.65 16.17,11.43 R4.1 | LPT.1 13.28,66.73 DBM.1
  Bottom 0.254: LPT.1 12.34,63.14 12.34,18.77 C7.+ 15.24,13.34 R4.1
P2
  Top 0.254: DBM.2 9.7,63.15 14.32,63.15 LPT.3 | RN5.2 26.67,76.83 IC4.1
  Bottom 0.254: RN5.2 21.77,76.83 DBM.2
P3
  Top 0.254: IC4.2 26.67,74.3 RN5.3 22.02,72.18 22.02,66.11 17.47,61.57 16.71,61.57 15.46,60.33 LPT.5 13.72,61.21 DBM.3
P4
  Top 0.254: LPT.7 13.95,58.45 DBM.4 | RN5.4 26.67,71.75 IC4.3
  Bottom 0.254: RN5.4 19.32,71.75 10.46,62.9 10.46,60.02 DBM.4
P5
  Top 0.254: LPT.9 9.32,55.24 DBM.5 | RN5.5 26.67,69.22 IC4.4
  Bottom 0.254: RN5.5 19.29,69.22 16,65.92 16,65.16 14.97,64.14 14.23,64.14 13.45,63.36 13.45,56.4 LPT.9
P6
  Top 0.254: 14.61,52.93 LPT.11 | 14.61,52.93 16,54.33 16,55.72 16.93,56.64 17.66,56.64 18.29,57.27 18.29,60.83 RN5.6 26.67,66.67 IC4.5 | 14.61,52.93 DBM.6
P7
  Top 0.254: IC4.6 26.67,64.14 RN5.7 18.88,58.88 18.88,55.34 17.52,53.98 16.8,53.98 16,53.18 16,51.56 LPT.13 DBM.7
P8
  Top 0.254: DBM.8 9.12,47.62 LPT.15 15.88,48.9 15.88,50.52 16.66,51.31 17.37,51.31 19.57,53.51 19.57,57.03 RN5.8 26.67,61.59 IC4.7
P9
  Top 0.254: IC4.8 26.67,59.05 RN5.9 24.13,52.99 17.49,46.35 15.88,46.35 LPT.17 9.32,45.09 DBM.9
P10
  Top 0.254: RN3.2 25.78,15.49 25.78,15.12 28.84,12.06 OK10.4 | LPT.19 9.55,42.55 DBM.10
  Bottom 0.254: LPT.19 12.9,40.84 12.9,28.38 RN3.2
P11
  Top 0.254: LPT.21 9.78,40.01 DBM.11 | RN3.3 26.67,17.14 OK11.4
  Bottom 0.254: RN3.3 13.46,30.36 13.46,38.86 LPT.21
P12
  Top 0.254: RN3.4 28.57,22.86 OK12.4 | DBM.12 13.51,36.37 LPT.23
  Bottom 0.254: RN3.4 22.98,22.86 15.88,29.97 15.88,36.2 LPT.23
P13
  Top 0.254: 14.61,34.62 LPT.25 | 23.66,25.57 14.61,34.62 | DBM.13 9.91,34.62 14.61,34.62 | 23.66,25.57 RN3.5 | OK13.4 25.4,27.3 23.66,25.57
P14
  Top 0.254: LPT.2 15.98,64.24 12.44,64.24 11.32,65.35 DBM.14
  Bottom 0.254: RN3.6 27.94,32.38 OK14.4 30.91,34.09 30.91,50.07 18.54,62.44 18.54,64.01 LPT.2
P15
  Top 0.254: RN3.8 27.94,37.47 OK15.4 | LPT.4 15.97,61.69 14.16,61.69 13.27,62.59 DBM.15
  Bottom 0.254: LPT.4 20.44,59.57 20.44,56.06 27.79,48.72 29.69,48.72 30.33,48.08 30.33,38.58 OK15.4
P16
  Top 0.254: LPT.6 15.98,59.16 13.94,59.16 13.28,59.82 DBM.16
  Bottom 0.254: 28.87,42.55 OK16.4 | RN3.7 25.93,32.91 25.93,39.61 28.87,42.55 | 28.87,42.55 25.17,46.24 25.17,47.5 23.61,49.06 23.01,49.06 21.13,50.94 21.13,52.91 17.39,56.64 16.66,56.64 15.97,57.33 15.97,59.15 LPT.6
P17
  Top 0.254: RN3.9 25.34,37.4 25.34,44.13 28.83,47.62 OK17.4 | LPT.8 15.96,56.6 13.73,56.6 13.26,57.07 DBM.17
  Bottom 0.254: OK17.4 27.93,47.62 17.77,57.78 LPT.8
PCGND
  Top 0.254: LPT.24 17.14,37.12 22.34,31.93 24.61,31.93 24.78,31.76 26.7,29.84 OK13.3 | OK12.3 28.73,24.28 17.93,24.28 R21.1 10.16,16.51 C7.- | 29.21,55.88 C4.2 22.4,49.07 22.4,45.09 | C23.2 29.21,55.88 | 29.21,55.88 IC4.9 30.97,60.81 30.97,80.51 | 30.97,80.51 32.25,80.51 C3.2 | 30.97,80.51 25.26,80.51 RN5.1 19.68,79.38 DC/DC.3 C22.2 | 22.4,45.09 22.4,44.27 C5.2 | 22.4,45.09 LPT.18 15.96,43.9 15.96,43.73 | 15.96,43.73 LPT.20 | OK-SIG.3 C21.- T2.1 39.37,6.99 R7.1 35.56,8.26 OK10.3 | DBM.22 9.65,43.26 10.13,43.73 15.96,43.73
  Top 0.305: OK14.3 27.94,34.92 24.78,31.76 | OK13.3 29.84,29.84 30.48,30.48 30.48,35.56 30.48,39.37 29.84,40.01 OK15.3 30.48,41.27 30.48,44.45 29.84,45.09 OK16.3 30.48,46.35 30.48,49.53 29.84,50.16 OK17.3
  Bottom 0.254: DBM.25 DBM.24 DBM.23 DBM.22 DBM.21 DBM.20 DBM.19 DBM.18 | OK10.3 30.3,15.7 30.3,18.59 OK11.3 30.3,20.78 30.3,23.67 OK12.3 30.3,25.86 30.3,28.75 OK13.3 | LPT.10 LPT.12 LPT.14 LPT.16 LPT.18 | LPT.20 LPT.22 LPT.24
PCV5
  Top 0.254: 23.65,47.55 28.58,52.47 30.88,52.47 C23.1 | C5.1 24.61,41.76 24.61,46.59 23.65,47.55 | 23.65,47.55 23.57,47.55 C4.1 | 22.74,14.49 RN3.1 | VPC.A 5.2,14.49 22.74,14.49 | 22.74,14.49 22.74,12.18 R4.2 22.23,10.16 T1.3 24.13,4.45 R1.2 | DC/DC.4 C22.1 | RN1.1 IC4.10
  Bottom 0.254: 25.86,78.25 21.09,78.25 DC/DC.4 | 25.86,78.25 26.18,77.93 26.18,67.44 28.21,65.41 30.48,65.41 IC4.10 36.83,58.42 C23.1 | 25.86,78.25 30.17,82.55 C3.1 | RN3.1 25.25,16.99 25.25,23.34 24.46,24.13 22.5,24.13 21.73,24.9 21.73,38.88 C5.1
V5
  Top 0.254: C35.2 79.38,81.92 IC6.20 72.39,80.64 RN6.1 OKP5.8 50.16,75.56 C33.1 53.34,66.67 OKP6.8 | C34.2 78.74,37.47 C43.1 | C42.1 57.15,41.27 IC3.14 48.9,37.47 C36.2 | 66.67,95.89 C31.1 | OKP4.8 66.67,95.89 | OKP3.8 56.38,94.48 65.27,94.48 66.67,95.89 | C39.2 OKP9.8 80.64,52.07 | 80.64,52.07 ..A D1.C 93.35,43.18 5V.2 | 80.64,52.07 80.64,56.52 C30.1 | C41.2 44.45,96.52 OKP2.8 40.41,93.34 | C6.1 50.16,52.7 OKP7.8 | 40.41,93.34 40.41,94.84 C38.2 | 40.41,93.34 33.89,86.83 X2.1 17.64,78.74 DC/DC.2 C37.2 8.38,78.74 C14.+ | OKP8.8 62.23,52.07 C2.1 | RN4.1 49.53,20.32 IC2.14
  Bottom 0.254: 54.45,25.25 58.89,25.25 61.1,23.04 63.96,23.04 64.77,23.85 64.77,24.43 65.56,25.23 67.48,25.23 C32.1 69.67,23.04 69.67,15.73 72.07,13.34 C13.1 | 54.45,25.25 54.45,21.43 IC2.14 | 54.45,25.25 54.45,25.56 C40.2 54.43,27.76 54.43,36.37 IC3.14 | C42.1 C2.1 | OKP5.8 54.15,81.74 54.15,88.71 54.97,89.53 56.85,89.53 57.67,90.36 57.67,91.27 55.6,93.34 OKP3.8 53.34,93.34 C41.2 | 85.09,87.63 85.72,88.27 OFF.A | 85.09,87.63 C35.2 S-OUT.10 | OUT.10 85.09,87.63 | 81.74,36.37 C34.2 | 89.53,37.47 88.44,36.37 81.74,36.37 | S-IN.10 80.64,35.27 81.74,36.37 | 89.53,37.47 D1.C | IN.10 89.53,37.47 | OKP8.8 65.44,53.37 73.06,53.37 C39.2 | OKP7.8 45.09,46.99 C36.2 | C33.1 50.16,57.78 C6.1

### Text on the board
tNames: P9 | P8 | P7 | P6 | P5 | P4 | P3 | P2 | GND | 5V | P17 | P16 | P15 | P14 | P13 | P12 | P11 | P10 | GND | P1
tValues: 5V | - | + | info@virtualsilicon.ch | License: CERN-OHL-P V2 | 153-01C LinuxCNC LPT mode X adapter